# EAGLE schematic 1 Level Convertor (EAGLE 8.2.1)
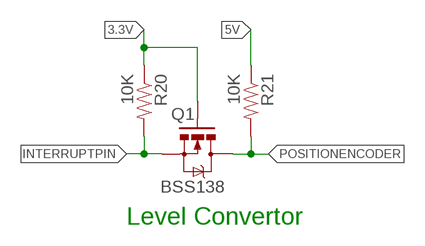
[diagram p0: schematic, sheet 1]

## Parts
Q1  BSS138  MOSFET-NCHANNELSMD  [SOT23-3]
R20  10K  RESISTOR1206  [1206]
R21  10K  RESISTOR1206  [1206]

## Nets
3.3V [VDD]: Q1.1(G) R20.1
5V [VSERVO]: R21.1
INTERRUPTPIN: Q1.2(S) R20.2
POSITIONENCODER: Q1.3(D) R21.2

## Notes on the sheet
- Level Convertor

## Library data of the parts
Q1 = SparkFun:MOSFET-NCHANNEL
R20 R21 = SparkFun:RESISTOR: Resistor Basic schematic elements and footprints for 0603, 1206, and PTH resistors.

## Net classes
0 default: width 0.2 mm, clearance 0.2 mm
1 VSERVO: width 0.8 mm, clearance 0.2 mm
2 VDD: width 0.5 mm, clearance 0.2 mm